# EAGLE schematic vykonova deska (EAGLE 9.0.1)
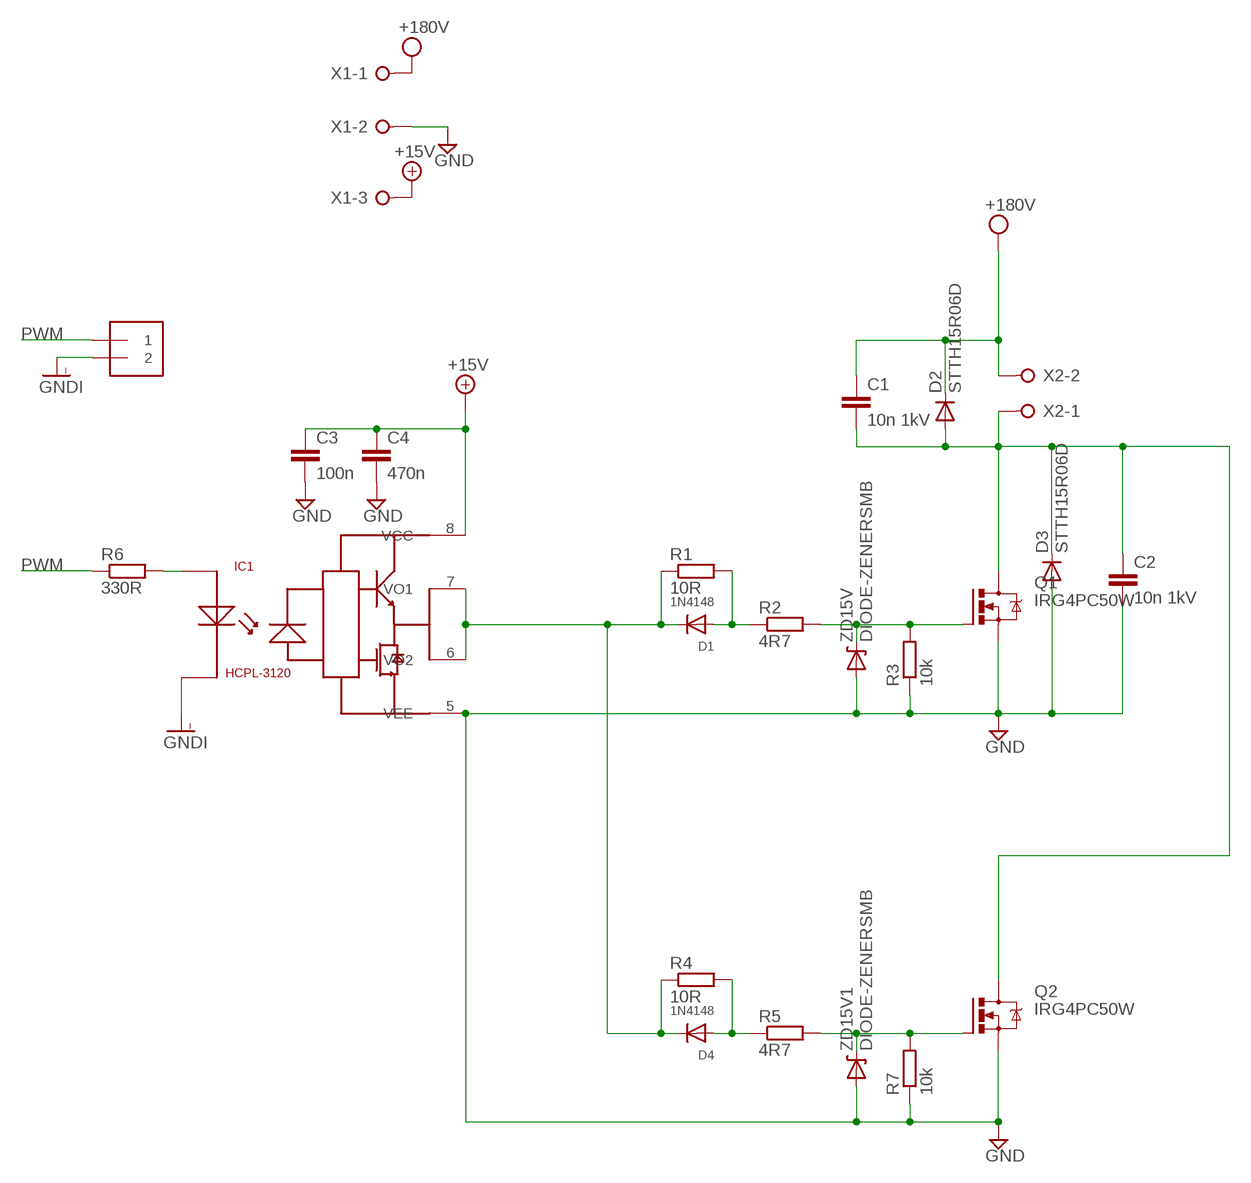
[diagram p0: schematic, sheet 1]

## Parts
C1  10n 1kV  C-EU102-043X133  [C102-043X133]
C2  10n 1kV  C-EU102-043X133  [C102-043X133]
C3  100n  C-EUC0603  [C0603]
C4  470n  C-EUC0603  [C0603]
D1  1N4148  DIODESMA  [SMADIODE]
D2  STTH15R06D  1N4004  [DO41-10]
D3  STTH15R06D  1N4004  [DO41-10]
D4  1N4148  DIODESMA  [SMADIODE]
IC1  HCPL-3120  [DIL08-OPTO]
PWM_IN  1X2-3.5MM  [1X2-3.5MM]
Q1  IRG4PC50W  IRFPC40  [TO247BV]
Q2  IRG4PC50W  IRFPC40  [TO247BV]
R1  10R  R-EU_R0603  [R0603]
R2  4R7  R-EU_R0603  [R0603]
R3  10k  R-EU_R0603  [R0603]
R4  10R  R-EU_R0603  [R0603]
R5  4R7  R-EU_R0603  [R0603]
R6  330R  R-EU_R0603  [R0603]
R7  10k  R-EU_R0603  [R0603]
X1  W237-3N  [W237-3N]
X2  W237-2N  [W237-2N]
ZD15V  DIODE-ZENERSMB  [SMB-DIODE]
ZD15V1  DIODE-ZENERSMB  [SMB-DIODE]

## Nets
+15V: C3.1 C4.1 IC1.8(VCC) X1.3
GND: C2.2 C3.2 C4.2 D3.A IC1.5(VEE) Q1.S Q2.S R3.1 R7.1 X1.2 ZD15V1.A ZD15V.A
GNDI: IC1.3(CATHODE) PWM_IN.2
N$2: D1.C D4.C IC1.6(VO2) IC1.7(VO1) R1.1 R4.1
N$3: D1.A R1.2 R2.1
N$4: Q1.G R2.2 R3.2 ZD15V.C
N$5: C1.2 C2.1 D2.A D3.C Q1.D Q2.D X2.1
N$6: D4.A R4.2 R5.1
N$7: Q2.G R5.2 R7.2 ZD15V1.C
N$9: IC1.2(ANODE) R6.2
PWM: PWM_IN.1 R6.1
VCC: C1.1 D2.C X1.1 X2.2 ; supply symbol labelled +180V

## Library data of the parts
C1-C4 = resistor:C-EU: CAPACITOR, European symbol
D1 D4 = adafruit:DIODE: Diode SMADIODE - SMA Surface Mount Package 20V 1A Schottky Diode Digikey: 641-1014-6-ND DO-1N4148 - Through Hole Small Current Diode SOD-123 20V 1 A (.5mV Vf) Schottky Diode - Digikey: MBRX120TPMSCT-ND SOD-323 10V 570mA (.38mV Vf, 3ns) Schottky Diode - Digikey: ZLLS410CT-ND SOD-523 30V 30mA Schottky Diode (RB751S-40TE61) - Digikey: RB751S-40TE61CT-ND SOT23-R/W - SOT23 Package (R = Solder Paste/Reflow Ovens, W = Hand-Soldering) BAT54Film 40V 300mA - Digikey: 497-7162-1-ND
D2 D3 = adafruit:1N4004: DIODE General purpose 1N400x type rectifier (With bigger pads) http://www.ladyada.net/library/pcb/eaglelibrary.html
IC1 = _moje:HCPL-3120
PWM_IN = adafruit:1X2: 3.5mm Terminal block http://www.ladyada.net/library/pcb/eaglelibrary.html
Q1 Q2 = transistor-power:IRFPC40: N-CHANNEL MOS FET
R1-R7 = resistor:R-EU_: RESISTOR, European symbol
X1 = con-wago-508:W237-3N: WAGO SREW CLAMP; OC_FARNELL: unknown; OC_NEWARK: unknown
X2 = con-wago-508:W237-2N: WAGO SREW CLAMP; OC_FARNELL: unknown; OC_NEWARK: unknown
ZD15V ZD15V1 = SparkFun-DiscreteSemi:DIODE-ZENER: Zener Diode Production Part - 8199 3.4V Zener Voltage